# Altium schematic sheet UART_USB.SchDoc: UART to USB FT232
size A4; Organization: Gateway; Address1: University of Colorado; Address2: Boulder; DocumentNumber: 6; Revision: 1; SheetNumber: 6; SheetTotal: 6; Rule: PcbType=ProtelPcb
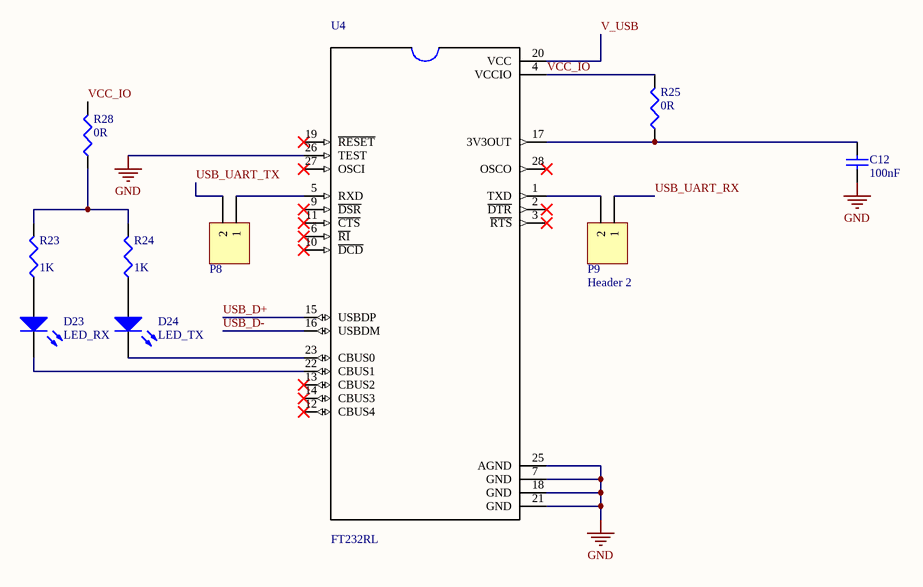
[diagram p0: UART_USB.SchDoc]

## Parts
C12  value 100nF  [1608[0603]]  (hidden comment: CL10F104ZO8NNNC)
D23  LED_RX  [1608[0603]]
D24  LED_TX  [1608[0603]]
P8  Header 2  [HDR1X2]  (value not drawn)
P9  Header 2  [HDR1X2]
R23  value 1K  [1608[0603]]  (hidden comment: MCT06030C1001FP500)
R24  value 1K  [1608[0603]]  (hidden comment: MCT06030C1001FP500)
R25  value 0R  [C1206]  (hidden comment: MCT0603MZ0000ZP500)
R28  value 0R  [C1206]  (hidden comment: MCT0603MZ0000ZP500)
U4  FT232RL  [SOP65P780X200-28N]

## Nets
GND: C12.2 U4.7(GND) U4.18(GND) U4.21(GND) U4.25(AGND) U4.26(TEST)
USB_D+: U4.15(USBDP)
USB_D-: U4.16(USBDM)
USB_UART_RX: P9.1
USB_UART_TX: P8.2
V_USB: U4.20(VCC)
VCC_IO: R25.2 R28.2 U4.4(VCCIO)
NetC12_1: C12.1 R25.1 U4.17(3V3OUT)
NetD23_1: D23.1(A) R23.1
NetD23_2: D23.2(K) U4.22(CBUS1)
NetD24_1: D24.1(A) R24.1
NetD24_2: D24.2(K) U4.23(CBUS0)
NetP8_1: P8.1 U4.5(RXD)
NetP9_2: P9.2 U4.1(TXD)
NetR23_2: R23.2 R24.2 R28.1

Not connected (* = marked no-connect by the designer): U4 2(~{DTR})* 3(~{RTS})* 6(~{RI})* 9(~{DSR})* 10(~{DCD})* 11(~{CTS})* 12(CBUS4)* 13(CBUS2)* 14(CBUS3)* 19(~{RESET})* 27(OSCI)* 28(OSCO)*

## Notes on the sheet
- Title
- Size:
- Date:
- A4
- Number:
- Time:
- Revision:
- Sheet
- of
- File:

## Library data of the parts
C12 = Cap: CAP CER 0.1UF 16V X7R 0603; Manufacturer: Samsung Electro-Mechanics; Published: 8-Jun-2000; LatestRevisionDate: 17-Jul-2002; LatestRevisionNote: Re-released for DXP Platform.; PackageReference: RAD-0.3; Publisher: Altium Limited; PackageDescription: Radial Cap, Thru-Hole; 2 Leads; 0.3 in Pin Spacing; Digi-Key Part Number: 1276-1258-1-ND; Manufacturer Part Number: CL10F104ZO8NNNC; ComponentLink1Description: Digi-Key Link; ComponentLink1URL: https://www.digikey.com/product-detail/en/samsung-electro-mechanics/CL10F104ZO8NNNC/1276-1258-1-ND/3889344
D23 = LED2: LED RED DIFFUSED 0603 SMD; Manufacturer: OSRAM Opto Semiconductors Inc.; Manufacturer Part Number: LS L29K-H1J2-1-Z; Digi-Key Part Number: 475-1195-1-ND; ComponentLink1URL: https://www.digikey.com/product-detail/en/osram-opto-semiconductors-inc/LG-L29K-F2J1-24-Z/475-3118-1-ND/4899549; ComponentLink1Description: Digi-Key Link
D24 = LED2: LED YELLOW DIFFUSED 0603 SMD; Manufacturer: OSRAM Opto Semiconductors Inc.; Manufacturer Part Number: LY L29K-H1K2-26-Z; Digi-Key Part Number: 475-1196-1-ND; ComponentLink1URL: https://www.digikey.com/product-detail/en/osram-opto-semiconductors-inc/LY-L29K-H1K2-26-Z/475-1196-1-ND/810357; ComponentLink1Description: Digi-Key Link
P8 P9 = Header 2: Header, 2-Pin; LatestRevisionDate: 17-Jul-2002; LatestRevisionNote: Re-released for DXP Platform.; Publisher: Altium Limited
R23 R24 = Res3: RES SMD 1K OHM 1% 1/8W 0603; Manufacturer: Vishay Beyschlag; Digi-Key Part Number: MCT0603-1.00K-CFCT-ND; ComponentLink1URL: https://www.digikey.com/product-detail/en/vishay-beyschlag/MCT06030C1001FP500/MCT0603-1.00K-CFCT-ND/2607875; ComponentLink1Description: Digi-Key URL; Manufacturer Part Number: MCT06030C1001FP500
R25 R28 = Res3: RES 0 OHM JUMPER 1/8W 0603; Manufacturer: Vishay Beyschlag; Digi-Key Part Number: 749-1745-1-ND; Manufacturer Part Number: MCT0603MZ0000ZP500; ComponentLink1URL: https://www.digikey.com/product-detail/en/vishay-beyschlag/MCT0603MZ0000ZP500/749-1745-1-ND/7348053; ComponentLink1Description: Digi-Key Link
U4 = FT232RL-REEL: USB Bridge, USB to UART USB 2.0 UART Interface 28-SSOP; Manufacturer: FTDI, Future Technology Devices International Ltd; MF: FTDI,; Package: SSOP-28 FTDI; MP: FT232RL-REEL; Price: None; SnapEDA_Link: https://www.snapeda.com/parts/FT232RL-REEL/FTDI%2C%20Future%20Technology%20Devices%20International%20Ltd/view-part/?ref=snap; Availability: Available; Value: *; ComponentLink1URL: https://www.digikey.com/product-detail/en/ftdi-future-technology-devices-international-ltd/FT232RL-REEL/768-1007-1-ND/1836402; Digi-Key Part Number: 768-1007-1-ND; ComponentLink1Description: Digi-Key Link; Manufacturer Part Number: FT232RL-REEL